# EAGLE design FR_Schematic (EAGLE 9.5.2)
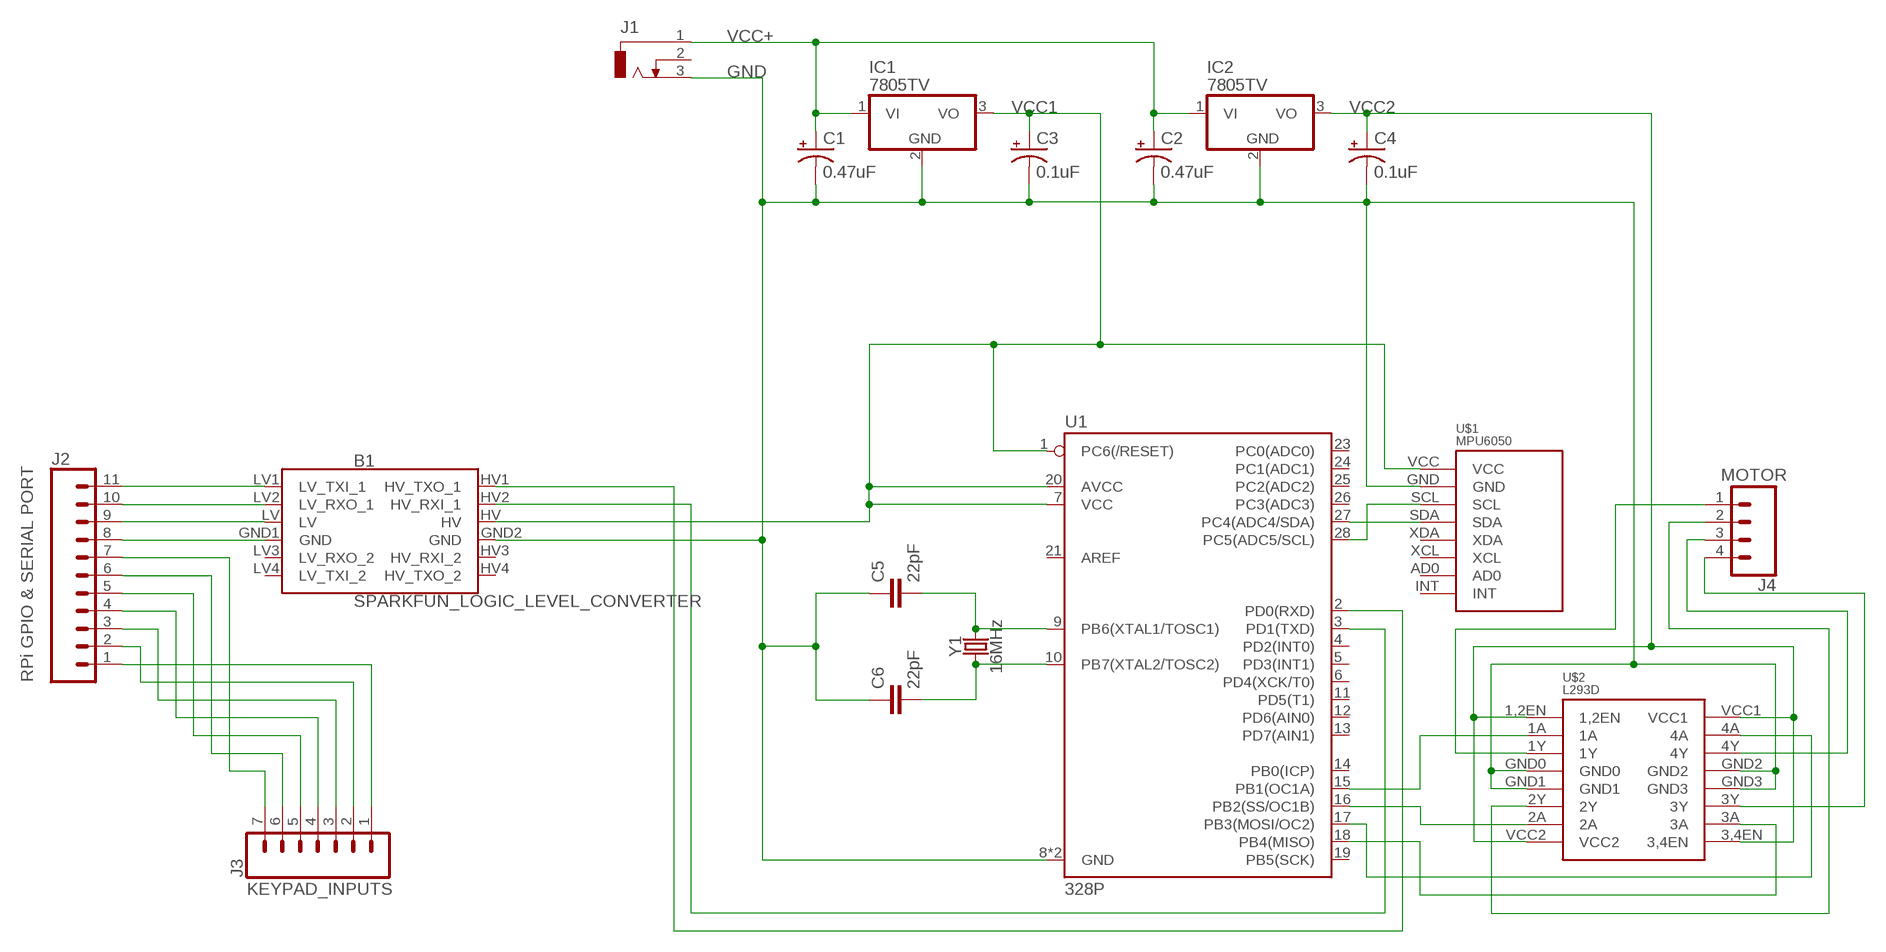
[diagram p0: schematic, sheet 1]

## Parts
B1  SPARKFUN_LOGIC_LEVEL_CONVERTER  [SPARKFUN_LOGIC_LEVEL_CONVERTER]
C1  0.47uF  10UF-POLAR-RADIAL-2.5MM-25V-20%  [CPOL-RADIAL-2.5MM-5MM]
C2  0.47uF  10UF-POLAR-RADIAL-2.5MM-25V-20%  [CPOL-RADIAL-2.5MM-5MM]
C3  0.1uF  CPOL-USE1.8-4  [E1,8-4]
C4  0.1uF  CPOL-USE1.8-4  [E1,8-4]
C5  22pF  22PF-PTH-2.54MM-200V-5%  [CAP-PTH-2.54]
C6  22pF  22PF-PTH-2.54MM-200V-5%  [CAP-PTH-2.54]
IC1  7805TV  [TO220V]
IC2  7805TV  [TO220V]
J1  DCJ0303  [DCJ0303]
J2  CONN_11  [1X11]
J3  CONN_07  [1X07]
J4  CONN_04PTH  [1X04]
U1  328P  ATMEGA328P_PDIP  [DIP28]
U$1  MPU6050  [MPU6050]
U$2  L293D  [L293D]
Y1  16MHz  CRYSTAL-16MHZPTH-HC49US  [HC49US]

## Nets
GND: B1.GND2(GND) C1.2(-) C2.2(-) C3.- C4.- C5.1 C6.1 IC1.2(GND) IC2.2(GND) J1.3 U1.8(GND) U1.22(GND) U$1.GND U$2.GND0 U$2.GND1 U$2.GND2 U$2.GND3
N$1: B1.HV1(HV_TXO_1) U1.2(PD0(RXD))
N$2: B1.HV2(HV_RXI_1) U1.3(PD1(TXD))
N$3: B1.LV1(LV_TXI_1) J2.11
N$4: B1.LV2(LV_RXO_1) J2.10
N$5: C6.2 U1.10(PB7(XTAL2/TOSC2)) Y1.1
N$6: C5.2 U1.9(PB6(XTAL1/TOSC1)) Y1.2
N$7: B1.LV J2.9
N$8: B1.GND1(GND) J2.8
N$9: J2.7 J3.7
N$10: J2.6 J3.6
N$11: J2.5 J3.5
N$12: J2.4 J3.4
N$13: J2.3 J3.3
N$14: J2.2 J3.2
N$15: J2.1 J3.1
N$16: U1.27(PC4(ADC4/SDA)) U$1.SDA
N$17: U1.28(PC5(ADC5/SCL)) U$1.SCL
N$18: U1.15(PB1(OC1A)) U$2.1A
N$19: U1.16(PB2(SS/OC1B)) U$2.2A
N$20: U1.17(PB3(MOSI/OC2)) U$2.4A
N$21: U1.18(PB4(MISO)) U$2.3A
N$22: J4.1 U$2.1Y
N$23: J4.2 U$2.2Y
N$24: J4.3 U$2.4Y
N$25: J4.4 U$2.3Y
VCC1: B1.HV C3.+ IC1.3(VO) U1.1(PC6(/RESET)) U1.7(VCC) U1.20(AVCC) U$1.VCC
VCC2: C4.+ IC2.3(VO) U$2.1,2EN U$2.3,4EN U$2.VCC1 U$2.VCC2
VCC+: C1.1(+) C2.1(+) IC1.1(VI) IC2.1(VI) J1.1
Unconnected: B1.HV3(HV_RXI_2) B1.HV4(HV_TXO_2) B1.LV3(LV_RXO_2) B1.LV4(LV_TXI_2) J1.2 U1.4(PD2(INT0)) U1.5(PD3(INT1)) U1.6(PD4(XCK/T0)) U1.11(PD5(T1)) U1.12(PD6(AIN0)) U1.13(PD7(AIN1)) U1.14(PB0(ICP)) U1.19(PB5(SCK)) U1.21(AREF) U1.23(PC0(ADC0)) U1.24(PC1(ADC1)) U1.25(PC2(ADC2)) U1.26(PC3(ADC3)) U$1.AD0 U$1.INT U$1.XCL U$1.XDA

## Notes on the sheet
- MOTOR
- RPi GPIO & SERIAL PORT
- KEYPAD_INPUTS

## Library data of the parts
B1 = SparkFun-Boards:SPARKFUN_LOGIC_LEVEL_CONVERTER: SparkFun Logic Level Converter -Bi-Directional This is the mechnical outline for the 3.3V - 5V bi directional logic level converter. *Note, the "LOCK" Package has the header pins staggered by an offset of 5 mils (off center line), so that when you slide a row of standard 0.1" headers into the PTH pads, it will hold position vertically. See the follwing turorial for more information on this type of special footprints: Sneaky Footprints <https://www.sparkfun.com/tutorials/114> SparkFun Products: SparkFun Logic Level Converter - Bi-Directional <https://www.sparkfun.com/products/12009>
C1 C2 = SparkFun-Capacitors:10UF-POLAR: 10.0µF polarized capacitors A capacitor is a passive two-terminal electrical component used to store electrical energy temporarily in an electric field.; PROD_ID: CAP-08440; VALUE: 10uF
C3 C4 = rcl:CPOL-US: POLARIZED CAPACITOR, American symbol; SPICEPREFIX: C
C5 C6 = SparkFun-Capacitors:22PF: 22pF ceramic capacitors A capacitor is a passive two-terminal electrical component used to store electrical energy temporarily in an electric field.; PROD_ID: CAP-09128
IC1 IC2 = linear:78*: Positive VOLTAGE REGULATOR Source: http://cache.national.com/ds/LM/LM78L05.pdf http://www.fairchildsemi.com/ds/LM/LM7805.pdf
J1 = con-jack:DCJ0303: DC POWER JACK Source: DCJ0303.pdf; OC_FARNELL: unknown; OC_NEWARK: unknown
J2 = SparkFun-Connectors:CONN_11: Multi connection point. Often used as Generic Header-pin footprint for 0.1 inch spaced/style header connections On any of the 0.1 inch spaced packages, you can populate with these: Break Away Headers - Straight <https://www.sparkfun.com/products/116> (PRT-00116) Break Away Male Headers - Right Angle <https://www.sparkfun.com/products/553> (PRT-00553) Female Headers <https://www.sparkfun.com/products/115> (PRT-00115) Break Away Headers - Machine Pin <https://www.sparkfun.com/products/117> (PRT-00117) Break Away Female Headers - Swiss Machine Pin <https://www.sparkfun.com/products/743> (PRT-00743) For SCREWTERMINALS and SPRING TERMINALS visit here: Screw Terimnals on SparkFun.com <https://www.sparkfun.com/search/results?term=Screw+Terminals> (5mm/3.5mm/2.54mm spacing) This device is also useful as a general connection point to wire up your design to another part of your project. Our various solder wires solder well into these plated through hole pads. Hook-Up Wire - Assortment (Stranded, 22 AWG) <https://www.sparkfun.com/products/11375> (PRT-11375) Hook-Up Wire - Assortment (Solid Core, 22 AWG) <https://www.sparkfun.com/products/11367> (PRT-11367) View the entire wire category on our website here <https://www.sparkfun.com/categories/141>
J3 = SparkFun-Connectors:CONN_07: Multi connection point. Often used as Generic Header-pin footprint for 0.1 inch spaced/style header connections On any of the 0.1 inch spaced packages, you can populate with these: Break Away Headers - Straight <https://www.sparkfun.com/products/116> (PRT-00116) Break Away Male Headers - Right Angle <https://www.sparkfun.com/products/553> (PRT-00553) Female Headers <https://www.sparkfun.com/products/115> (PRT-00115) Break Away Headers - Machine Pin <https://www.sparkfun.com/products/117> (PRT-00117) Break Away Female Headers - Swiss Machine Pin <https://www.sparkfun.com/products/743> (PRT-00743) For SCREWTERMINALS and SPRING TERMINALS visit here: Screw Terimnals on SparkFun.com <https://www.sparkfun.com/search/results?term=Screw+Terminals> (5mm/3.5mm/2.54mm spacing) This device is also useful as a general connection point to wire up your design to another part of your project. Our various solder wires solder well into these plated through hole pads. Hook-Up Wire - Assortment (Stranded, 22 AWG) <https://www.sparkfun.com/products/11375> (PRT-11375) Hook-Up Wire - Assortment (Solid Core, 22 AWG) <https://www.sparkfun.com/products/11367> (PRT-11367) View the entire wire category on our website here <https://www.sparkfun.com/categories/141> Special notes: Molex polarized connector foot print use with SKU : PRT-08231 with associated crimp pins and housings. 1MM SMD Version SKU: PRT-10208 NOTES ON THE VARIANTS LOCK and LOCK_LONGPADS... This footprint was designed to help hold the alignment of a through-hole component (i.e. 6-pin header) while soldering it into place. You may notice that each hole has been shifted either up or down by 0.005 of an inch from it's more standard position (which is a perfectly straight line). This slight alteration caused the pins (the squares in the middle) to touch the edges of the holes. Because they are alternating, it causes a "brace" to hold the component in place. 0.005 has proven to be the perfect amount of "off-center" position when using our standard breakaway headers. Although looks a little odd when you look at the bare footprint, once you have a header in there, the alteration is very hard to notice. Also,if you push a header all the way into place, it is covered up entirely on the bottom side.
J4 = SparkFun-Connectors:CONN_04: Multi connection point. Often used as Generic Header-pin footprint for 0.1 inch spaced/style header connections On any of the 0.1 inch spaced packages, you can populate with these: Break Away Headers - Straight <https://www.sparkfun.com/products/116> (PRT-00116) Break Away Male Headers - Right Angle <https://www.sparkfun.com/products/553> (PRT-00553) Female Headers <https://www.sparkfun.com/products/115> (PRT-00115) Break Away Headers - Machine Pin <https://www.sparkfun.com/products/117> (PRT-00117) Break Away Female Headers - Swiss Machine Pin <https://www.sparkfun.com/products/743> (PRT-00743) For SCREWTERMINALS and SPRING TERMINALS visit here: Screw Terimnals on SparkFun.com <https://www.sparkfun.com/search/results?term=Screw+Terminals> (5mm/3.5mm/2.54mm spacing) This device is also useful as a general connection point to wire up your design to another part of your project. Our various solder wires solder well into these plated through hole pads. Hook-Up Wire - Assortment (Stranded, 22 AWG) <https://www.sparkfun.com/products/11375> (PRT-11375) Hook-Up Wire - Assortment (Solid Core, 22 AWG) <https://www.sparkfun.com/products/11367> (PRT-11367) View the entire wire category on our website here <https://www.sparkfun.com/categories/141> Special notes: Molex polarized connector foot print use with SKU : PRT-08231 with associated crimp pins and housings. 1MM SMD Version SKU: PRT-10208; PROD_ID: CONN-09696
U1 = SparkFun-IC-Microcontroller:ATMEGA328P_PDIP: Atmel 328P Through hole ATMEGA328P uC used in the Arduino 32kb flash, 1k EEPROM, 2k SRAM Datasheet <http://www.sparkfun.com/datasheets/Components/SMD/ATMega328.pdf> SparkFun Products Storefront component: AVR 28 Pin 20MHz 32K 6A/D - ATMega328P <https://www.sparkfun.com/products/9061> (COM-09061) SparkFun Simon Says - Through-Hole Soldering Kit <https://www.sparkfun.com/products/10547> (KIT-10547) SparkFun Learn to Solder - Simon Says <https://www.sparkfun.com/products/13708> (KIT-13708) SparkFun BigTime Watch Kit <https://www.sparkfun.com/products/11734> (KIT-11734) SparkFun ClockIt <https://www.sparkfun.com/products/10930> (KIT-10930) SparkFun Serial Enabled LCD Kit <https://www.sparkfun.com/products/10097> (LCD-10097) SparkFun Simon Tilts - Through Hole Soldering Kit <https://www.sparkfun.com/products/12634> (KIT-12634) SparkFun Frequency Counter Kit <https://www.sparkfun.com/products/10140> (KIT-10140) FabFM Radio Kit <https://www.sparkfun.com/products/11043> (KIT-11043) SparkFun Binary Blaster Kit <https://www.sparkfun.com/products/12037> (KIT-12037) SparkFun Metro-Gnome <https://www.sparkfun.com/products/9236> (KIT-09236) ATmega328 with Arduino Optiboot (Uno) <https://www.sparkfun.com/products/10524> (DEV-10524); PROD_ID: IC-09136
U$1 = myLib:MPU6050
U$2 = myLib:L293D
Y1 = SparkFun-Clocks:CRYSTAL-16MHZ: 16MHz Crystal Digikey Example <http://www.digikey.com/product-search/en?keywords=535-9122-1-ND> Frequency: 16MHz Frequency Stability: ±50ppm Frequency Tolerance: ±20ppm Load Capacitance: 18pF SparkFun Products: Pro Micro -5V/16MHz <https://www.sparkfun.com/products/12640> SparkFun Serial Enabled LCD Kit <https://www.sparkfun.com/products/10097>; PROD_ID: XTAL-08181; SF_ID: COM-00536

## Board
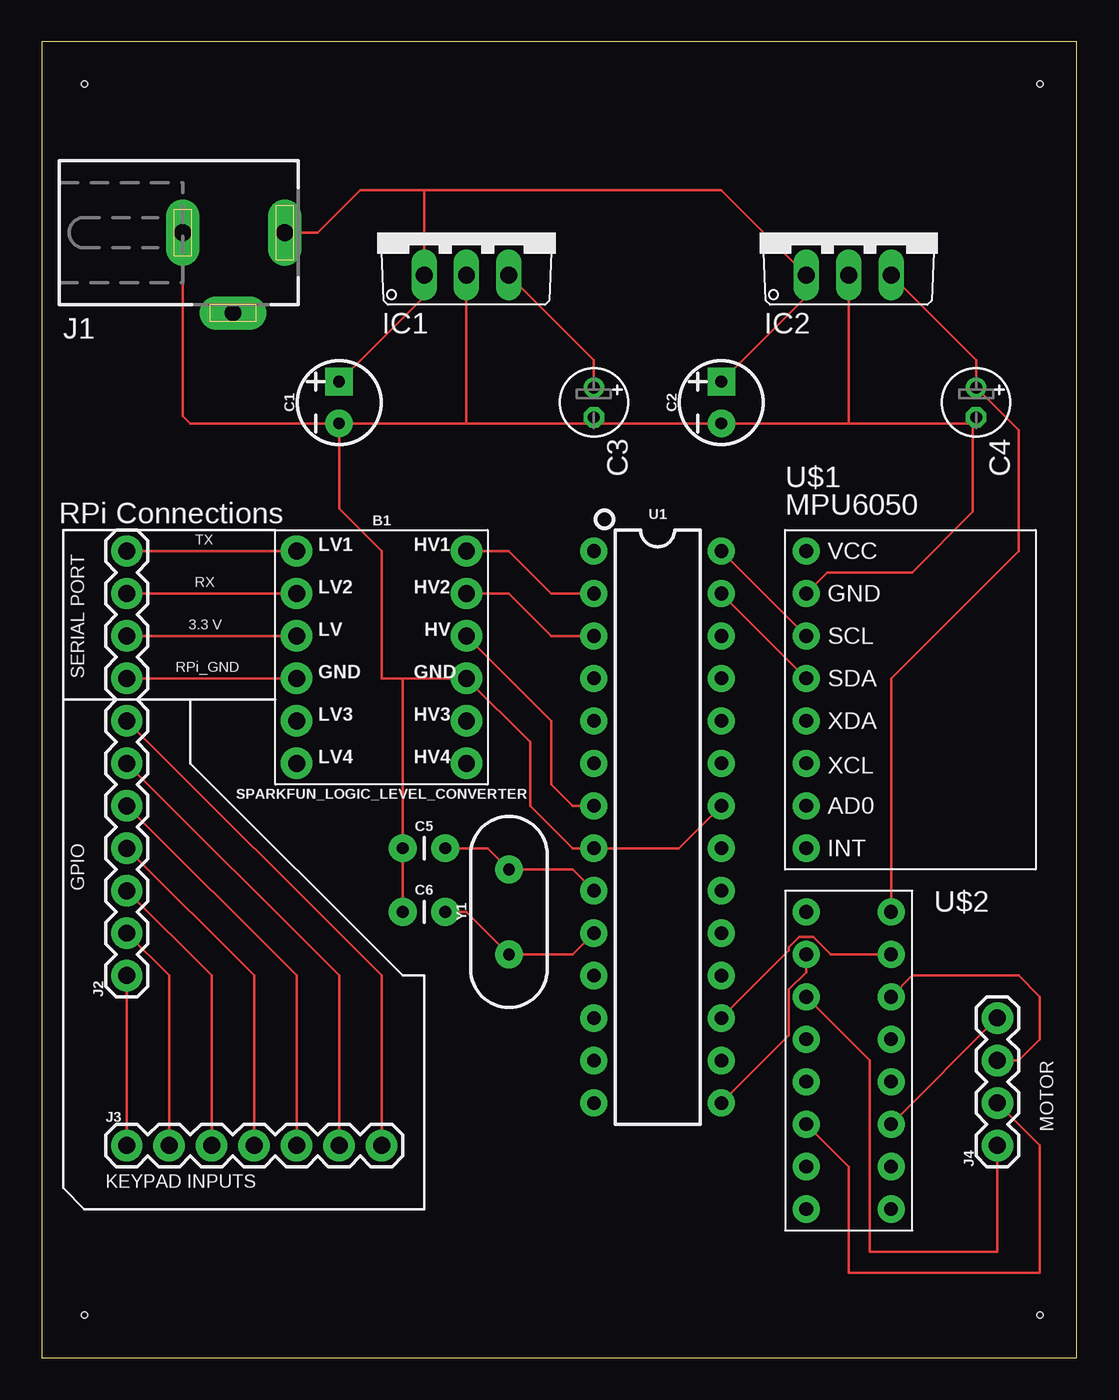
[diagram p1: board, top side]
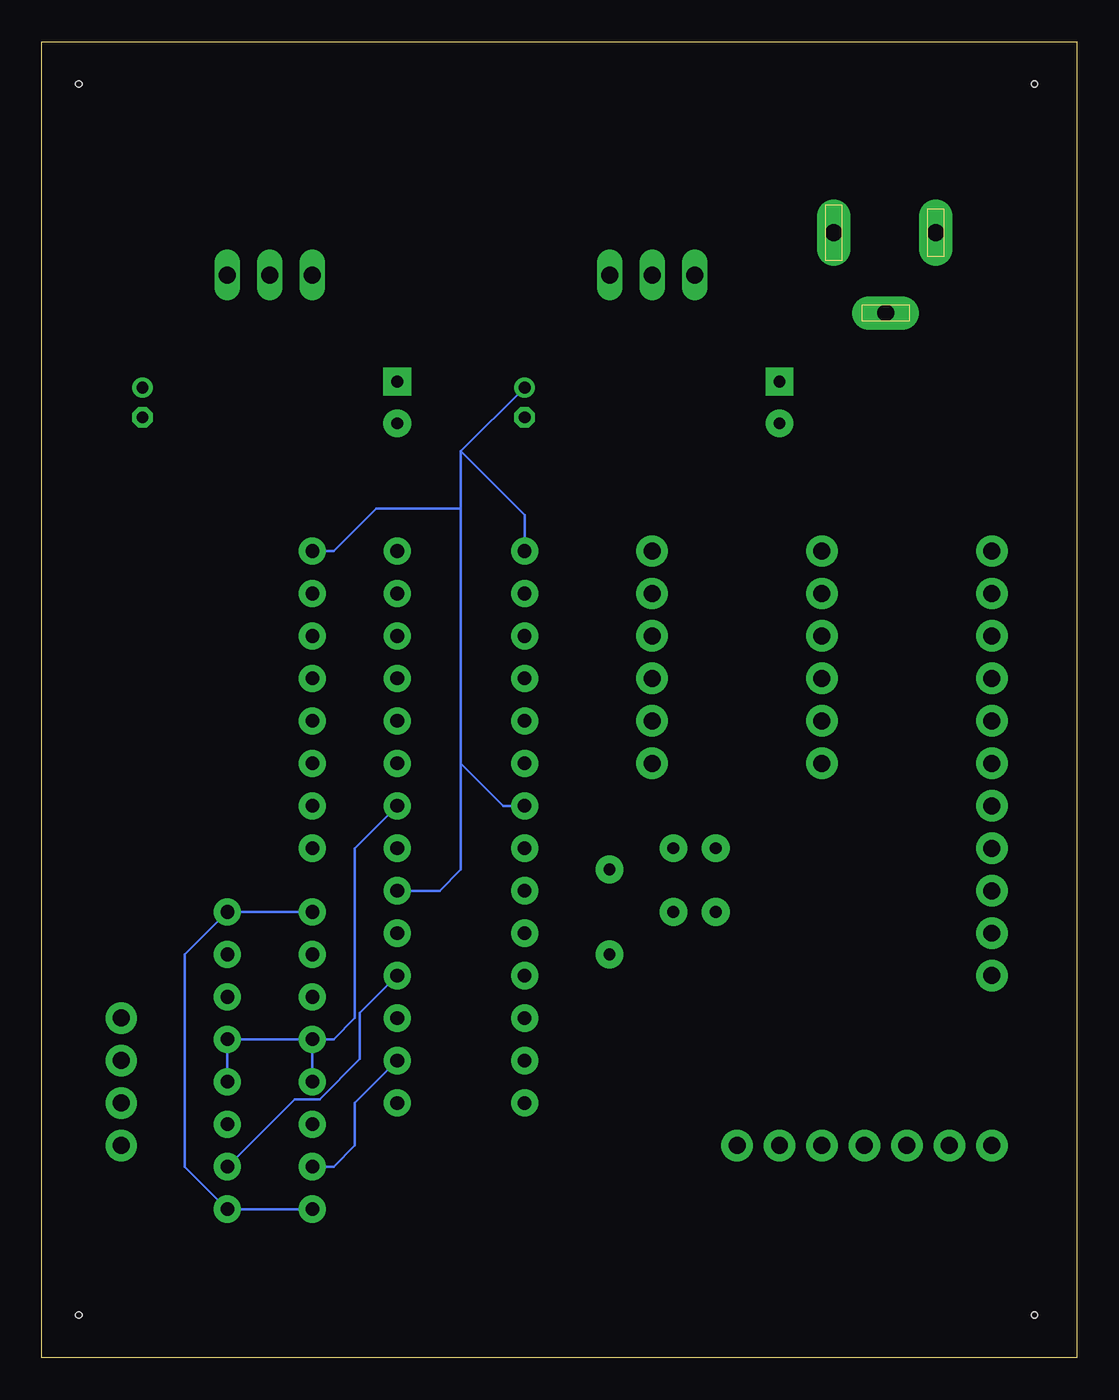
[diagram p2: board, bottom side, seen from below]

Size 61.9 x 78.73 mm. Coordinates in mm from the lower left corner, seen from the top.
Outline: 0,0 61.9,0 61.9,78.73 0,78.73 0,0
Copper layers (1*16): Top 0.035mm / dielectric 1.5mm / Bottom 0.035mm
Design rules "default": minimum track width 6mil, minimum drill 0.35mm, track to track 6mil, track to pad 6mil, pad to pad 6mil, via to via 6mil, smd to smd 6mil, copper to edge 40mil, drill to drill 6mil, minimum pad ring 10mil, minimum via ring 8mil, stop-mask expansion 4mil, vias tented up to drill 0mil, thermal gap 10mil
Holes 0.35 mm at 2.54,76.2 59.69,76.2 2.54,2.54 59.69,2.54

### Footprints (pad centres in the part's own frame; a part is rotated, then mirrored left to right if it is on the bottom)
SPARKFUN_LOGIC_LEVEL_CONVERTER = drill 1.016 pad 1.88: GND1 -5.08,-1.27; GND2 5.08,-1.27; HV 5.08,1.27; HV1 5.08,6.35; HV2 5.08,3.81; HV3 5.08,-3.81; HV4 5.08,-6.35; LV -5.08,1.27; LV1 -5.08,6.35; LV2 -5.08,3.81; LV3 -5.08,-3.81; LV4 -5.08,-6.35
CPOL-RADIAL-2.5MM-5MM = drill 0.7 pad 1.651 square: 1 1.25,0 | drill 0.7 pad 1.651: 2 -1.25,0
E1,8-4 = drill 0.711 pad 1.168: + -0.889,0 | drill 0.711 pad 1.168 octagon: - 0.889,0
CAP-PTH-2.54 = drill 0.7 pad 1.651: 1 -1.27,0; 2 1.27,0
TO220V = drill 1.016 long: 1 -2.54,-2.54; 2 0,-2.54; 3 2.54,-2.54
DCJ0303 = drill 1 pad 2 long: 1 0,3.1; 2 4.8,0; 3 0,-3
1X11 = drill 1.016 pad 1.88: 1 0,0; 2 2.54,0; 3 5.08,0; 4 7.62,0; 5 10.16,0; 6 12.7,0; 7 15.24,0; 8 17.78,0; 9 20.32,0; 10 22.86,0; 11 25.4,0
1X07 = drill 1.016 pad 1.88: 1 0,0; 2 2.54,0; 3 5.08,0; 4 7.62,0; 5 10.16,0; 6 12.7,0; 7 15.24,0
1X04 = drill 1.016 pad 1.88: 1 0,0; 2 2.54,0; 3 5.08,0; 4 7.62,0
DIP28 = drill 0.813 pad 1.626: 1 -16.51,-3.81; 2 -13.97,-3.81; 3 -11.43,-3.81; 4 -8.89,-3.81; 5 -6.35,-3.81; 6 -3.81,-3.81; 7 -1.27,-3.81; 8 1.27,-3.81; 9 3.81,-3.81; 10 6.35,-3.81; 11 8.89,-3.81; 12 11.43,-3.81; 13 13.97,-3.81; 14 16.51,-3.81; 15 16.51,3.81; 16 13.97,3.81; 17 11.43,3.81; 18 8.89,3.81; 19 6.35,3.81; 20 3.81,3.81; 21 1.27,3.81; 22 -1.27,3.81; 23 -3.81,3.81; 24 -6.35,3.81; 25 -8.89,3.81; 26 -11.43,3.81; 27 -13.97,3.81; 28 -16.51,3.81
MPU6050 = drill 0.813 pad 1.626: AD0 1.27,-16.51; GND 1.27,-3.81; INT 1.27,-19.05; SCL 1.27,-6.35; SDA 1.27,-8.89; VCC 1.27,-1.27; XCL 1.27,-13.97; XDA 1.27,-11.43
L293D = drill 0.813 pad 1.626: 1,2EN 1.27,-1.27; 1A 1.27,-3.81; 1Y 1.27,-6.35; 2A 1.27,-16.51; 2Y 1.27,-13.97; 3,4EN 6.35,-19.05; 3A 6.35,-16.51; 3Y 6.35,-13.97; 4A 6.35,-3.81; 4Y 6.35,-6.35; GND0 1.27,-8.89; GND1 1.27,-11.43; GND2 6.35,-8.89; GND3 6.35,-11.43; VCC1 6.35,-1.27; VCC2 1.27,-19.05
HC49US = drill 0.7 pad 1.651: 1 -2.54,0; 2 2.54,0

### Placement (x,y rotation side)
B1  20.32,41.91 0 top
C1  17.78,57.15 90 top
C2  40.64,57.15 90 top
C3  33.02,57.15 270 top
C4  55.88,57.15 270 top
C5  22.86,30.48 0 top
C6  22.86,26.67 0 top
IC1  25.4,67.31 0 top
IC2  48.26,67.31 0 top
J1  11.43,67.31 270 top
J2  5.08,22.86 90 top
J3  5.08,12.7 0 top
J4  57.15,12.7 90 top
U1  36.83,31.75 270 top
U$1  44.45,49.53 0 top
U$2  44.45,27.94 0 top
Y1  27.94,26.67 90 top

### Tracks (layer width: path | path; a pad name or v marks a point on that pad's centre or on a via)
GND
  Top 0.152: J1.3 8.43,56.34 8.89,55.88 17.76,55.88 | 17.76,55.88 C1.2 17.78,50.8 20.32,48.26 20.32,40.64 21.59,40.64 | IC1.2 25.4,55.88 | 25.4,55.88 17.76,55.88 | 25.4,55.88 32.64,55.88 C3.- 33.38,55.9 C2.2 48.26,55.9 | 48.26,55.9 55.52,55.9 55.69,56.07 | 55.69,56.07 C4.- | IC2.2 48.26,55.9 | U1.22 38.1,30.48 U1.8 31.75,30.48 29.21,33.02 29.21,36.83 B1.GND2 21.59,40.64 | 21.59,40.64 C5.1 C6.1 | U$1.GND 46.99,46.99 52.07,46.99 55.69,50.61 55.69,56.07
  Bottom 0.152: U$2.GND0 U$2.GND2 U$2.GND3 | U1.22 43.18,30.48 43.18,20.32 44.45,19.05 U$2.GND0 | U$2.GND0 U$2.GND1
N$1
  Top 0.152: B1.HV1 27.94,48.26 30.48,45.72 U1.2
N$2
  Top 0.152: B1.HV2 27.94,45.72 30.48,43.18 U1.3
N$3
  Top 0.152: J2.11 B1.LV1
N$4
  Top 0.152: B1.LV2 J2.10
N$5
  Top 0.152: U1.10 31.75,24.13 Y1.1 25.4,26.67 C6.2
N$6
  Top 0.152: U1.9 31.75,29.21 Y1.2 26.67,30.48 C5.2
N$7
  Top 0.152: J2.9 B1.LV
N$8
  Top 0.152: B1.GND1 J2.8
N$9
  Top 0.152: J2.7 20.32,22.86 J3.7
N$10
  Top 0.152: J2.6 17.78,22.86 J3.6
N$11
  Top 0.152: J3.5 15.24,22.86 J2.5
N$12
  Top 0.152: J2.4 12.7,22.86 J3.4
N$13
  Top 0.152: J2.3 10.16,22.86 J3.3
N$14
  Top 0.152: J2.2 7.62,22.86 J3.2
N$15
  Top 0.152: J2.1 J3.1
N$16
  Top 0.152: U1.27 U$1.SDA
N$17
  Top 0.152: U1.28 U$1.SCL
N$18
  Top 0.152: U1.15 44.68,19.28 44.68,22.02 45.72,23.06 U$2.1A
N$19
  Bottom 0.152: U1.16 43.18,15.24 43.18,12.7 44.45,11.43 U$2.2A
N$20
  Top 0.152: U$2.4A 47.19,24.13 46.15,25.17 45.29,25.17 44.68,24.56 44.68,24.36 U1.17
N$21
  Bottom 0.152: U1.18 42.88,20.62 42.88,17.88 45.29,15.47 46.76,15.47 U$2.3A
N$22
  Top 0.152: U$2.1Y 49.53,17.78 49.53,6.35 57.15,6.35 J4.1
N$23
  Top 0.152: U$2.2Y 48.26,11.43 48.26,5.08 59.69,5.08 59.69,12.7 J4.2
N$24
  Top 0.152: U$2.4Y 52.07,22.86 58.42,22.86 59.69,21.59 59.69,19.05 58.42,17.78 J4.3
N$25
  Top 0.152: J4.4 U$2.3Y
VCC1
  Top 0.152: B1.HV 30.48,38.1 30.48,34.29 31.75,33.02 U1.7 | IC1.3 33.02,59.69 C3.+
  Bottom 0.152: 36.83,50.8 36.83,54.23 | 36.83,50.8 36.83,35.56 | 36.83,35.56 34.29,33.02 U1.7 | 36.83,35.56 36.83,29.21 38.1,27.94 U1.20 | C3.+ 36.83,54.23 | U$1.VCC 44.45,48.26 41.91,50.8 36.83,50.8 | 36.83,54.23 33.02,50.42 U1.1
VCC2
  Top 0.152: IC2.3 55.88,59.69 C4.+ 58.42,55.5 58.42,48.26 50.8,40.64 U$2.VCC1
  Bottom 0.152: U$2.VCC2 U$2.3,4EN 53.34,11.43 53.34,24.13 U$2.VCC1 U$2.1,2EN
VCC+
  Top 0.152: J1.1 16.51,67.31 19.05,69.85 22.86,69.85 | 22.86,69.85 40.64,69.85 IC2.1 45.72,63.48 C2.1 | 22.86,69.85 IC1.1 22.86,63.48 C1.1

### Text on the board
tPlace: RPi Connections | TX | RX | 3.3 V | SERIAL PORT | RPi_GND | GPIO | MOTOR | KEYPAD INPUTS